# EAGLE design dwengo-1.1 (EAGLE 6.2)
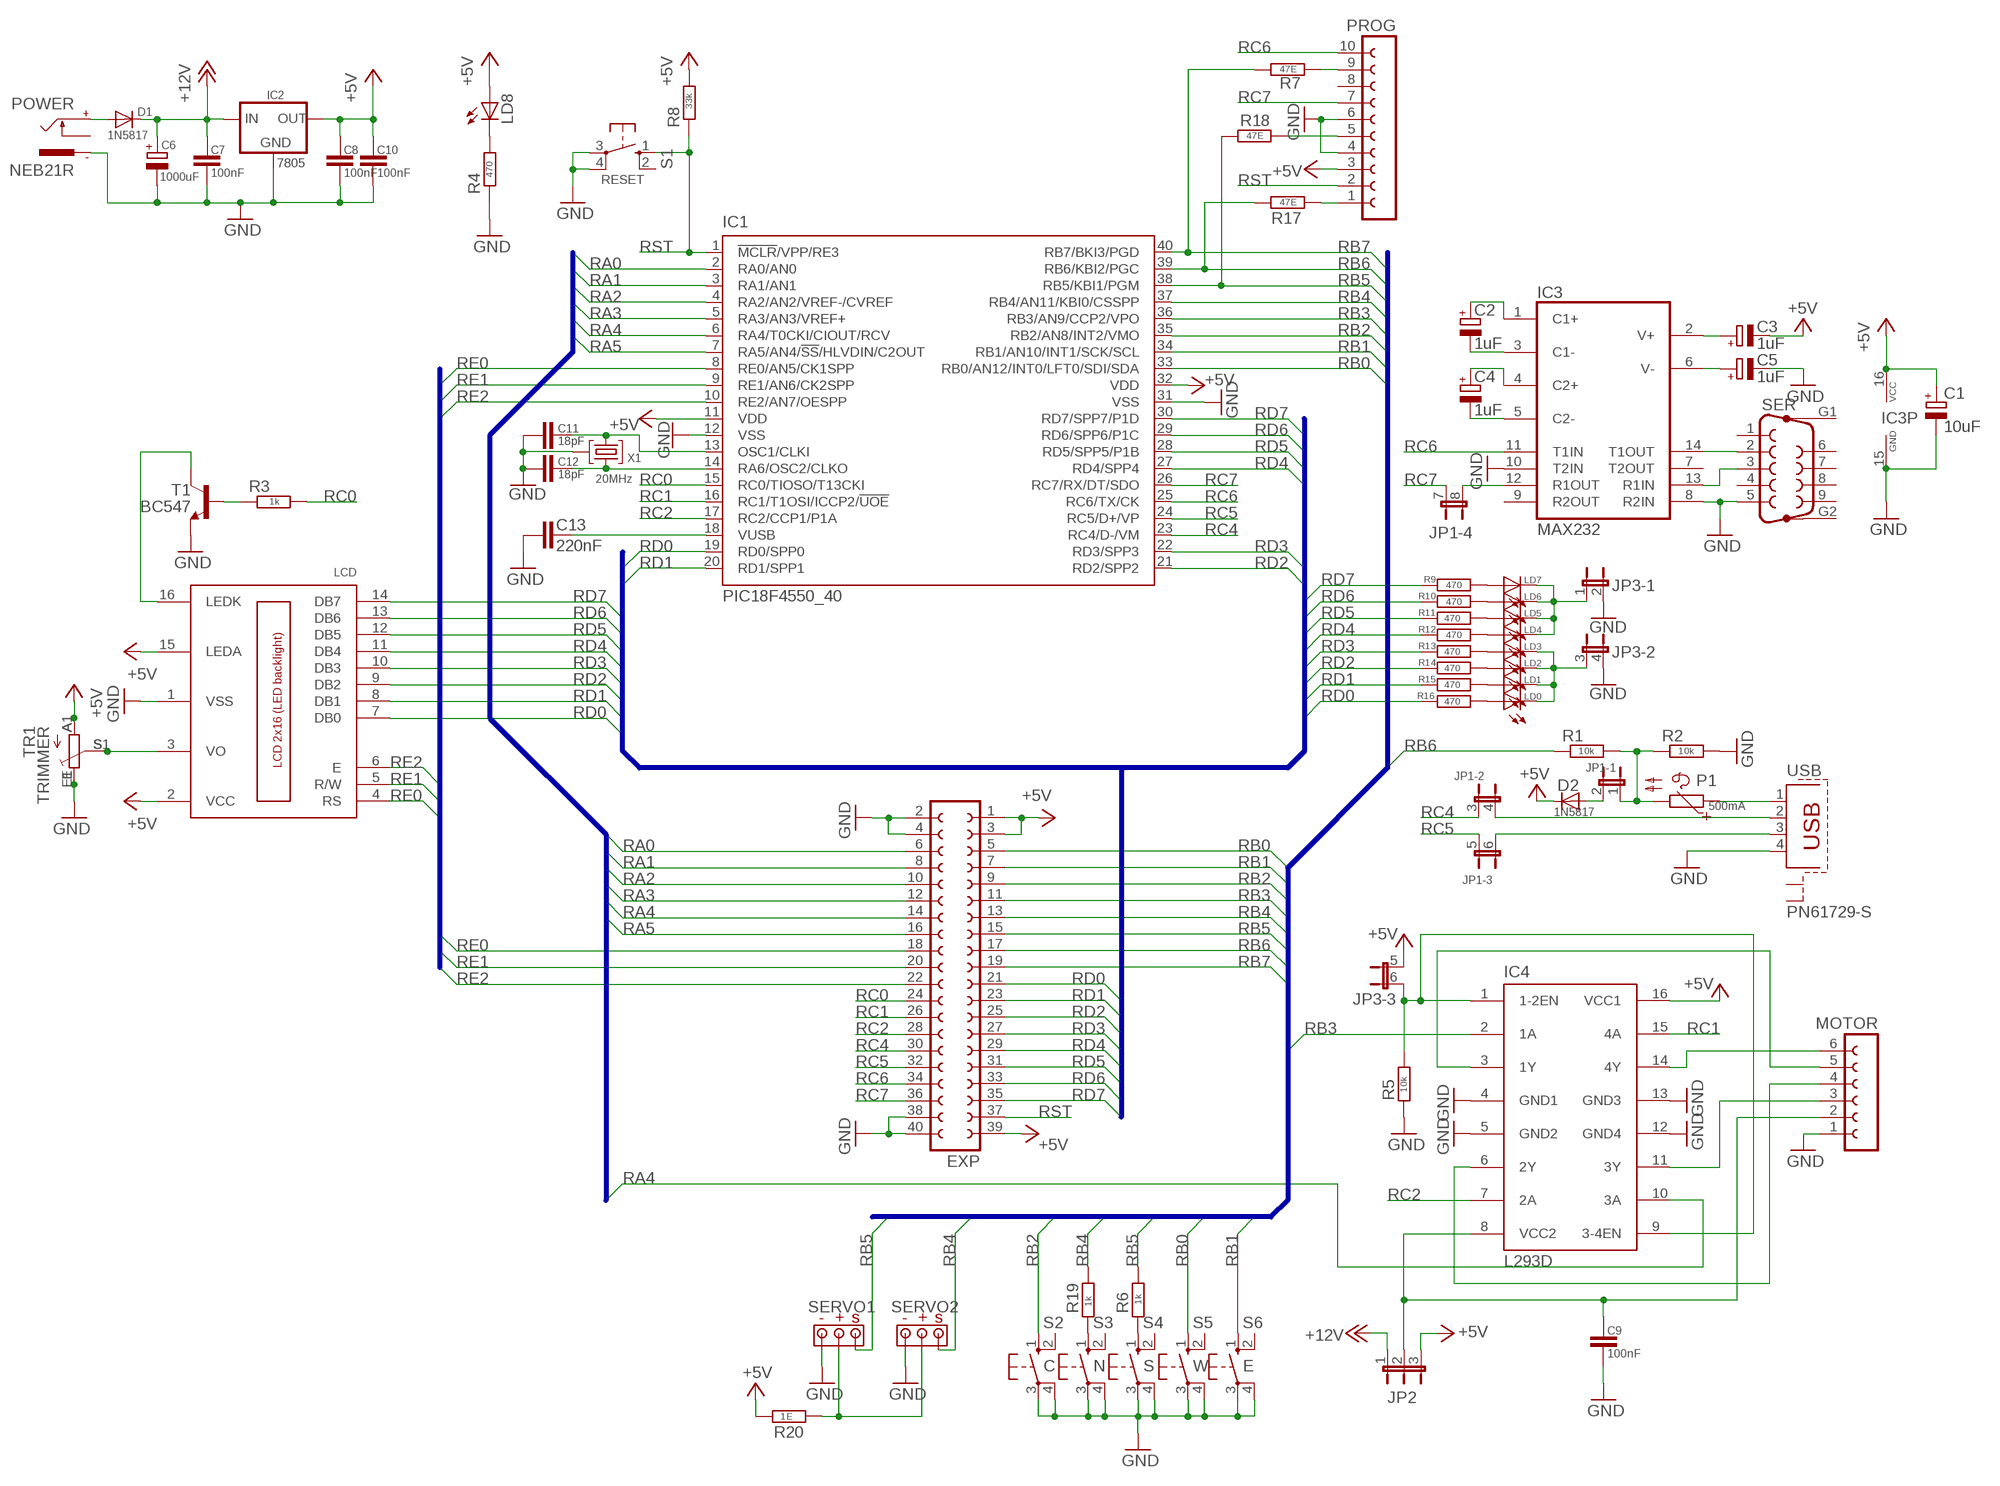
[diagram p0: schematic, sheet 1]

## Parts
C1  10uF  CPOL-EUE2-5  [E2-5]
C2  1uF  CPOL-EUE2-5  [E2-5]
C3  1uF  CPOL-EUE2-5  [E2-5]
C4  1uF  CPOL-EUE2-5  [E2-5]
C5  1uF  CPOL-EUE2-5  [E2-5]
C6  1000uF  CPOL-EUE5-10.5  [E5-10,5]
C7  100nF  C-EU050-025X075  [C-EU050-025X075]
C8  100nF  C-EU050-025X075  [C-EU050-025X075]
C9  100nF  C-EU050-025X075  [C-EU050-025X075]
C10  100nF  C-EU050-025X075  [C-EU050-025X075]
C11  18pF  C-EU050-024X044  [C-EU050-024X044]
C12  18pF  C-EU050-024X044  [C-EU050-024X044]
C13  220nF  C-EU050-035X075  [C-EU050-035X075]
D1  1N5817  1N4004  [DO41-10]
D2  1N5817  1N4004  [DO41-10]
EXP  FE20-2W  [FE20-2W]
IC1  PIC18F4550_40  PIC18F4455_40  [DIL40]
IC2  7805  78XXS  [78XXS]
IC3  MAX232  [DIL16]
IC4  L293D  [DIL16]
JP1  JP2_4  [JP2_4]
JP2  JP_3MOTOR  [JP_MOTOR]
JP3  JP3QE  [JP3Q]
LCD  LCD_2X16  [HY-1602F]
LD0  LED3MM  [LED3MM]
LD1  LED3MM  [LED3MM]
LD2  LED3MM  [LED3MM]
LD3  LED3MM  [LED3MM]
LD4  LED3MM  [LED3MM]
LD5  LED3MM  [LED3MM]
LD6  LED3MM  [LED3MM]
LD7  LED3MM  [LED3MM]
LD8  LED3MM  [LED3MM]
MOTOR  MOTOR  [MOTOR]
P1  500mA  POLYSWITCH  [POLYSWITCH]
POWER  NEB21R  [NEB21R]
PROG  PROG_CONNECTOR  [PROG_CONNECTOR]
R1  10k  R-EU_0204/7  [0204/7]
R2  10k  R-EU_0204/7  [0204/7]
R3  1k  R-EU_0204/7  [0204/7]
R4  470  R-EU_0204/7  [0204/7]
R5  10k  R-EU_0204/7  [0204/7]
R6  1k  R-EU_0204/7  [0204/7]
R7  47E  R-EU_0204/7  [0204/7]
R8  33k  R-EU_0204/7  [0204/7]
R9  470  R-EU_0204/7  [0204/7]
R10  470  R-EU_0204/7  [0204/7]
R11  470  R-EU_0204/7  [0204/7]
R12  470  R-EU_0204/7  [0204/7]
R13  470  R-EU_0204/7  [0204/7]
R14  470  R-EU_0204/7  [0204/7]
R15  470  R-EU_0204/7  [0204/7]
R16  470  R-EU_0204/7  [0204/7]
R17  47E  R-EU_0204/7  [0204/7]
R18  47E  R-EU_0204/7  [0204/7]
R19  1k  R-EU_0204/7  [0204/7]
R20  1E  R-EU_0204/7  [0204/7]
S1  10-XX  [B3F-10XX]
S2  10-XX  [B3F-10XX]
S3  10-XX  [B3F-10XX]
S4  10-XX  [B3F-10XX]
S5  10-XX  [B3F-10XX]
S6  10-XX  [B3F-10XX]
SER  F09HP  [F09HP]
SERVO1  SERVO  [SERVO]
SERVO2  SERVO  [SERVO]
T1  BC547  [TO92]
TR1  TRIMMER  [TRIMMER]
USB  PN61729-S  [PN61729-S]
X1  20MHz  CRYSTAL_RES  [CRYSTAL_RES]

## Nets
+5V: C1.+ C3.- C8.2 C10.2 D2.C EXP.1 EXP.3 EXP.39 IC1.11(VDD) IC1.32(VDD) IC2.OUT IC3.16(VCC) IC4.16(VCC1) JP2.3 JP3.5 LCD.2(VCC) LCD.15(LEDA) LD8.A PROG.3 R8.2 R20.1 TR1.A TR1.A1
+12V: C6.+ C7.2 D1.C IC2.IN JP2.1
GND: C1.- C5.- C6.- C7.1 C8.1 C9.1 C10.1 C11.2 C12.2 C13.2 EXP.2 EXP.4 EXP.38 EXP.40 IC1.12(VSS) IC1.31(VSS) IC2.GND IC3.8(R2IN) IC3.10(T2IN) IC3.15(GND) IC4.4(GND1) IC4.5(GND2) IC4.12(GND4) IC4.13(GND3) JP3.2 JP3.4 LCD.1(VSS) MOTOR.1 POWER.- PROG.4 PROG.6 R2.2 R4.1 R5.1 S1.3(P) S1.4(P1) S2.3(P) S2.4(P1) S3.3(P) S3.4(P1) S4.3(P) S4.4(P1) S5.3(P) S5.4(P1) S6.3(P) S6.4(P1) SER.5 SERVO1.- SERVO2.- T1.1(E) TR1.E TR1.E1 USB.4 X1.P$1
N$1: C9.2 IC4.8(VCC2) JP2.2 MOTOR.2
N$2: C11.1 IC1.13(OSC1/CLKI) X1.2
N$3: C12.1 IC1.14(RA6/OSC2/CLKO) X1.1
N$14: C2.+ IC3.1(C1+)
N$15: C2.- IC3.3(C1-)
N$16: C4.+ IC3.4(C2+)
N$17: C4.- IC3.5(C2-)
N$18: IC3.13(R1IN) SER.3
N$37: LCD.3(VO) TR1.S TR1.S1
N$38: LD7.A R9.2
N$39: LD6.A R10.2
N$40: LD5.A R11.2
N$41: LD4.A R12.2
N$42: LD3.A R13.2
N$43: LD2.A R14.2
N$44: LD1.A R15.2
N$45: LD0.A R16.2
N$46: JP3.1 LD4.K(C) LD5.K(C) LD6.K(C) LD7.K(C)
N$47: JP3.3 LD0.K(C) LD1.K(C) LD2.K(C) LD3.K(C)
N$48: C13.1 IC1.18(VUSB)
N$49: C3.+ IC3.2(V+)
N$50: C5.+ IC3.6(V-)
N$51: IC3.14(T1OUT) SER.2
N$52: LCD.16(LEDK) T1.3(C)
N$53: LD8.K(C) R4.2
N$54: IC3.12(R1OUT) JP1.8
N$55: JP1.6 USB.3
N$58: R3.1 T1.2(B)
N$59: P1.1 USB.1
N$60: D2.A JP1.2
N$61: D1.A POWER.+
N$64: IC4.14(4Y) MOTOR.6
N$65: IC4.11(3Y) MOTOR.3
N$66: IC4.1(1-2EN) IC4.9(3-4EN) JP3.6 R5.2
N$67: IC4.6(2Y) MOTOR.4
N$68: IC4.3(1Y) MOTOR.5
N$70: JP1.4 USB.2
N$71: PROG.9 R7.2
N$72: PROG.1 R17.2
N$73: PROG.5 R18.2
N$74: JP1.1 P1.2 R1.1 R2.1
N$75: R19.1 S3.1(S)
N$76: R6.1 S4.1(S)
N$77: R20.2 SERVO1.+ SERVO2.+
RA0: EXP.6 IC1.2(RA0/AN0)
RA1: EXP.8 IC1.3(RA1/AN1)
RA2: EXP.10 IC1.4(RA2/AN2/VREF-/CVREF)
RA3: EXP.12 IC1.5(RA3/AN3/VREF+)
RA4: EXP.14 IC1.6(RA4/T0CKI/CIOUT/RCV) IC4.10(3A)
RA5: EXP.16 IC1.7(RA5/AN4/!SS!/HLVDIN/C2OUT)
RB0: EXP.5 IC1.33(RB0/AN12/INT0/LFT0/SDI/SDA) S5.1(S)
RB1: EXP.7 IC1.34(RB1/AN10/INT1/SCK/SCL) S6.1(S)
RB2: EXP.9 IC1.35(RB2/AN8/INT2/VMO) S2.1(S)
RB3: EXP.11 IC1.36(RB3/AN9/CCP2/VPO) IC4.2(1A)
RB4: EXP.13 IC1.37(RB4/AN11/KBI0/CSSPP) R19.2 SERVO2.S
RB5: EXP.15 IC1.38(RB5/KBI1/PGM) R6.2 R18.1 SERVO1.S
RB6: EXP.17 IC1.39(RB6/KBI2/PGC) R1.2 R17.1
RB7: EXP.19 IC1.40(RB7/BKI3/PGD) R7.1
RC0: EXP.24 IC1.15(RC0/TIOSO/T13CKI) R3.2
RC1: EXP.26 IC1.16(RC1/T1OSI/ICCP2/!UOE) IC4.15(4A)
RC2: EXP.28 IC1.17(RC2/CCP1/P1A) IC4.7(2A)
RC4: EXP.30 IC1.23(RC4/D-/VM) JP1.3
RC5: EXP.32 IC1.24(RC5/D+/VP) JP1.5
RC6: EXP.34 IC1.25(RC6/TX/CK) IC3.11(T1IN) PROG.10
RC7: EXP.36 IC1.26(RC7/RX/DT/SDO) JP1.7 PROG.7
RD0: EXP.21 IC1.19(RD0/SPP0) LCD.7(DB0) R16.1
RD1: EXP.23 IC1.20(RD1/SPP1) LCD.8(DB1) R15.1
RD2: EXP.25 IC1.21(RD2/SPP2) LCD.9(DB2) R14.1
RD3: EXP.27 IC1.22(RD3/SPP3) LCD.10(DB3) R13.1
RD4: EXP.29 IC1.27(RD4/SPP4) LCD.11(DB4) R12.1
RD5: EXP.31 IC1.28(RD5/SPP5/P1B) LCD.12(DB5) R11.1
RD6: EXP.33 IC1.29(RD6/SPP6/P1C) LCD.13(DB6) R10.1
RD7: EXP.35 IC1.30(RD7/SPP7/P1D) LCD.14(DB7) R9.1
RE0: EXP.18 IC1.8(RE0/AN5/CK1SPP) LCD.4(RS)
RE1: EXP.20 IC1.9(RE1/AN6/CK2SPP) LCD.5(R/W)
RE2: EXP.22 IC1.10(RE2/AN7/OESPP) LCD.6(E)
RST: EXP.37 IC1.1(!MCLR!/VPP/RE3) PROG.2 R8.1 S1.1(S)
Unconnected: IC3.7(T2OUT) IC3.9(R2OUT) POWER.C PROG.8 S1.2(S1) S2.2(S1) S3.2(S1) S4.2(S1) S5.2(S1) S6.2(S1) SER.1 SER.4 SER.6 SER.7 SER.8 SER.9 SER.G1 SER.G2 USB.S1 USB.S2

## Buses
RA[0..5]
RE[0..2]
RB[0..7]
RD[0..7]

## Notes on the sheet
- RESET
- C | N | S | W | E

## Library data of the parts
C1-C6 = rcl:CPOL-EU: POLARIZED CAPACITOR, European symbol
C7-C10 = dwengo:C-EU050-025X075
C11 C12 = dwengo:C-EU050-024X044
C13 = dwengo:C-EU050-035X075
D1 D2 = diode:1N4004: DIODE general purpose rectifier, 1 A
EXP = con-lsta:FE20-2W: FEMALE HEADER
IC1 = microchip:PIC18F4*_40: USB Microcontrollers with nanoWatt Technology High-Performance, Enhanced Flash, 28/40/44-Pin, Source: http://ww1.microchip.com/downloads/en/devicedoc/39632c.pdf
IC2 = v-reg:78XXS: VOLTAGE REGULATOR
IC3 = maxim:MAX232: RS232 TRANSEIVER
IC4 = st-microelectronics:L293D: PUSH-PULL 4 CHANNEL DRIVER
JP1 = dwengo:JP2_4
JP2 = dwengo:JP_3
JP3 = jumper:JP3QE: JUMPER
LCD = lcd_2x16_led_backlight:LCD_2X16
LD0 LD1-LD8 = dwengo:LED3MM
MOTOR = dwengo:MOTOR
P1 = dwengo:POLYSWITCH
POWER = con-lumberg:NEB21R: Klinkeneinbaukupplung
PROG = dwengo:PROG_CONNECTOR
R1-R20 = rcl:R-EU_: RESISTOR, European symbol
S1-S6 = switch-omron:10-XX: OMRON SWITCH
SER = con-subd:F09HP: SUB-D
SERVO1 SERVO2 = dwengo:SERVO
T1 = transistor:BC547: NPN TRANSISTOR
TR1 = dwengo:TRIMMER
USB = con-berg:PN61729-S: BERG USB connector
X1 = welek:CRYSTAL_RES

## Board
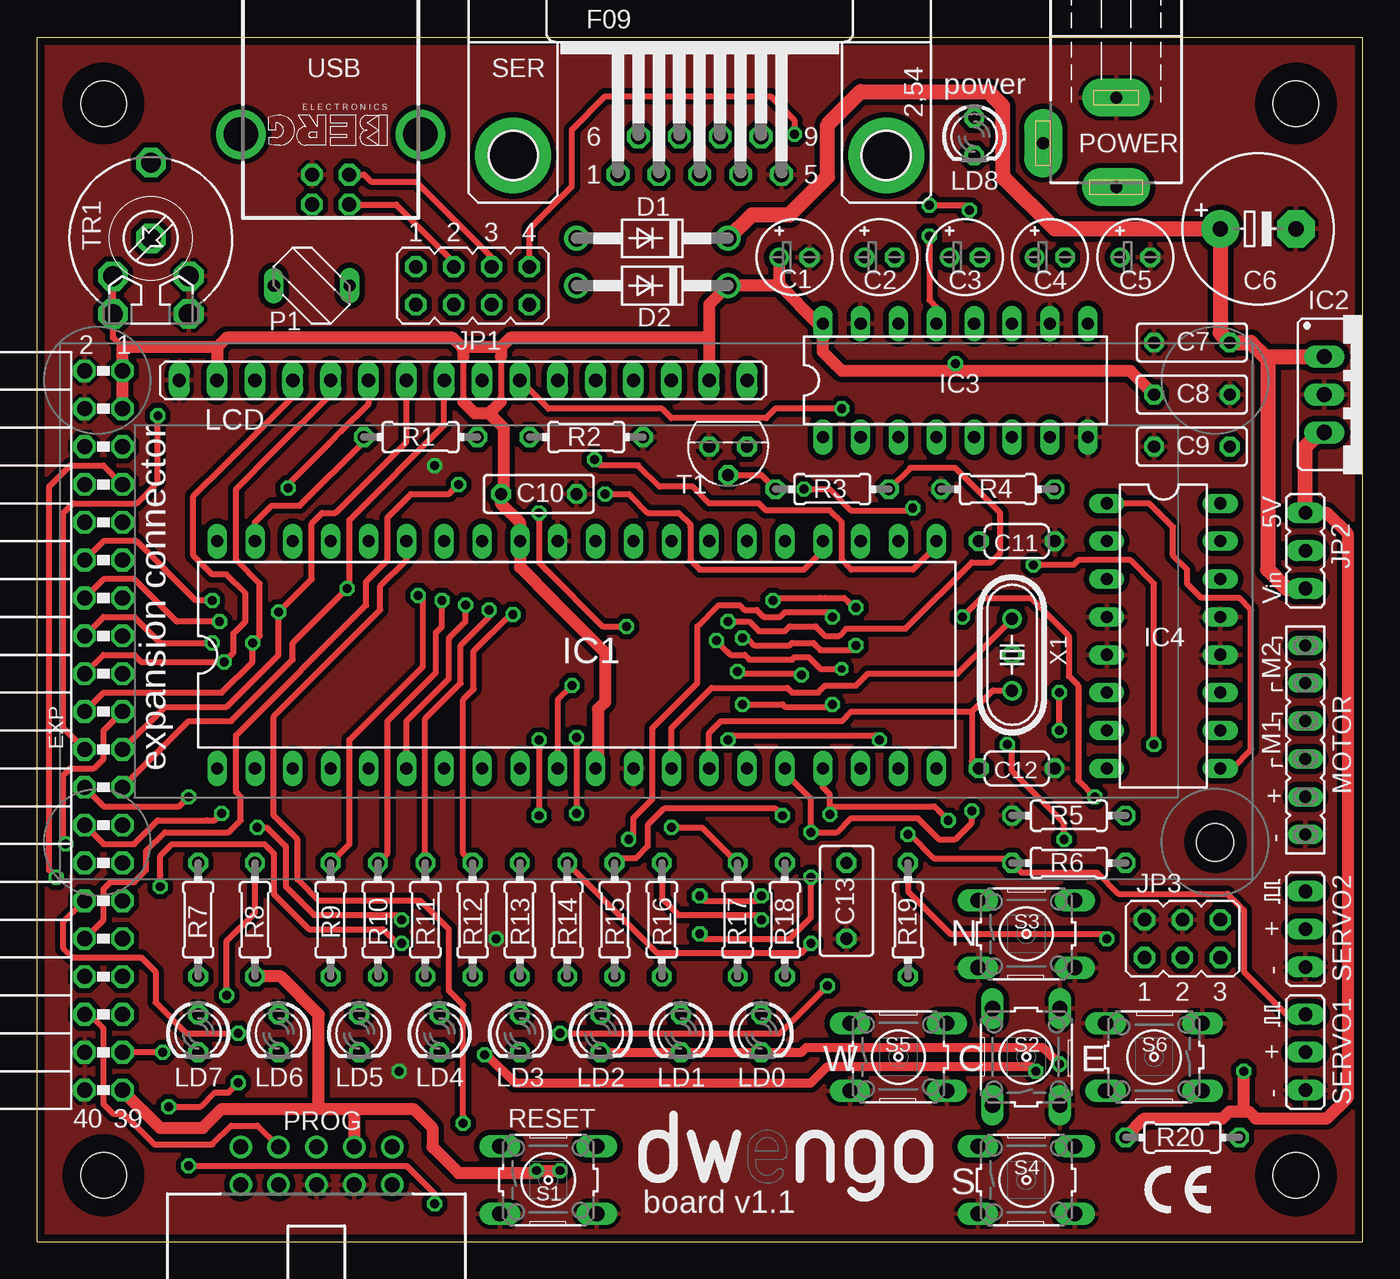
[diagram p1: board, top side]
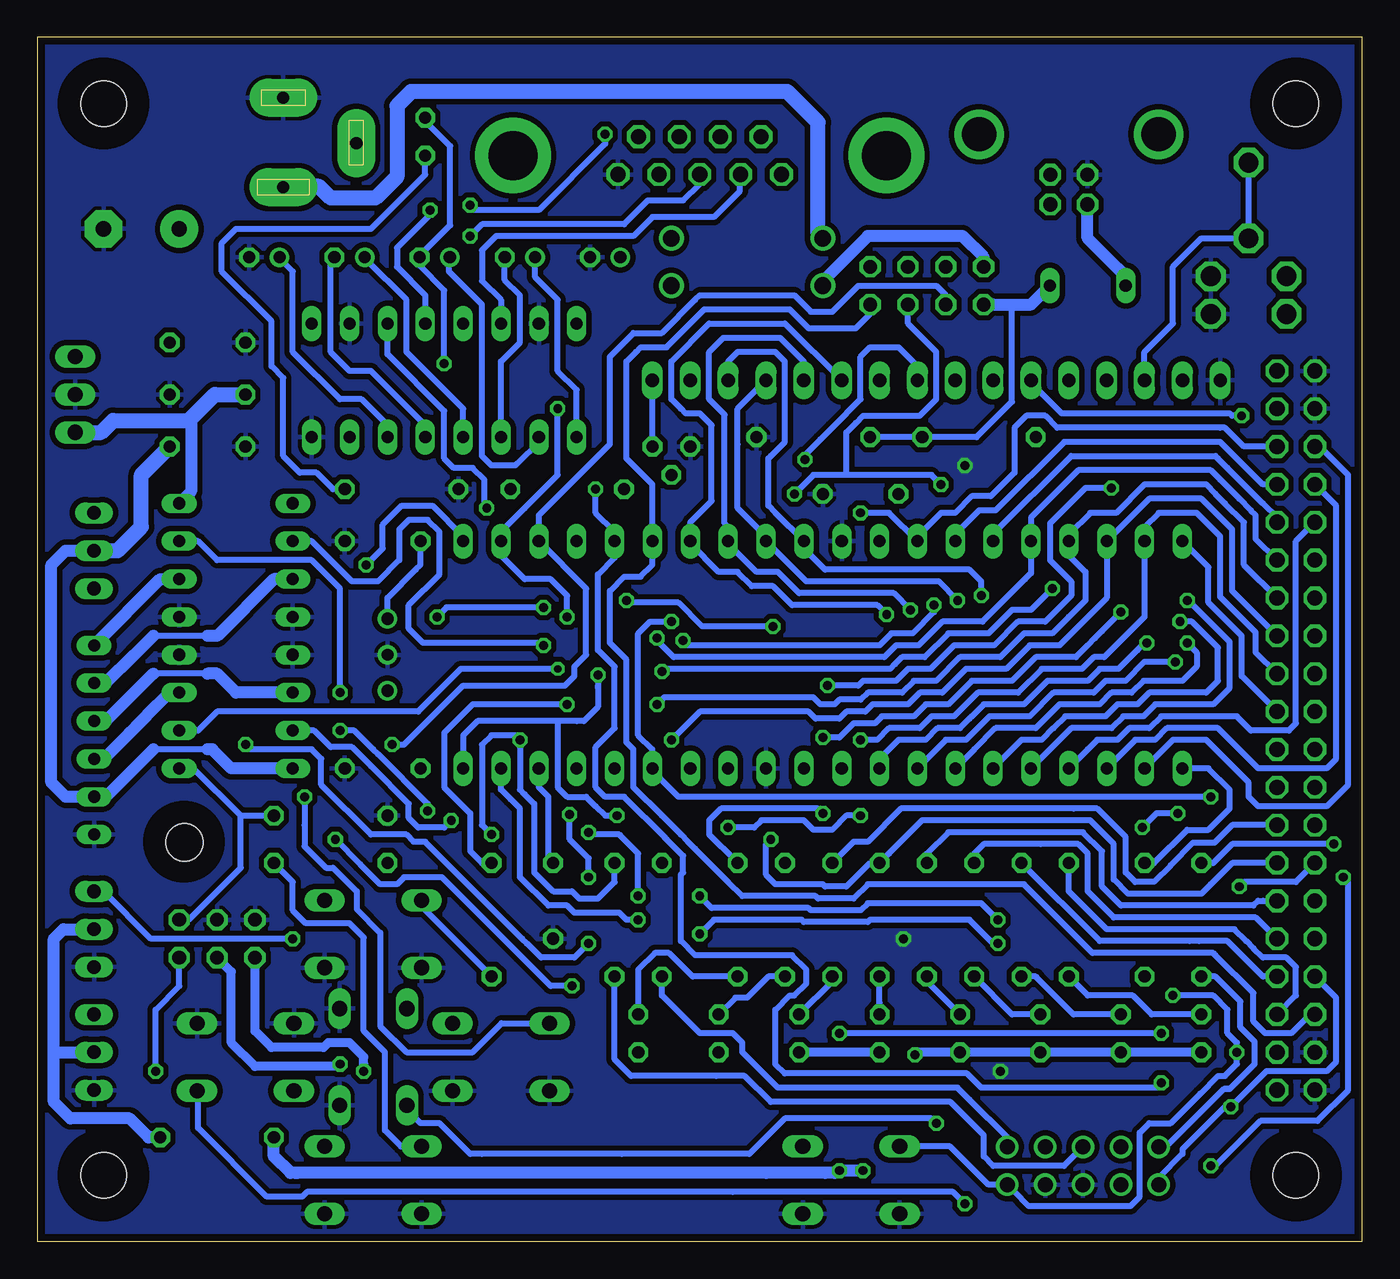
[diagram p2: board, bottom side, seen from below]

Size 88.9 x 80.8 mm. Coordinates in mm from the lower left corner, seen from the top.
Outline: 0,80.8 88.9,80.8 88.9,0 0,0 0,80.8
Copper layers (1*16): Top 0.035mm / dielectric 1.6mm / Bottom 0.035mm
Design rules: minimum track width 12mil, minimum drill 16mil, track to track 14mil, track to pad 14mil, pad to pad 14mil, via to via 14mil, smd to smd 14mil, copper to edge 20mil, drill to drill 16mil, minimum pad ring 10mil, minimum via ring 8mil, stop-mask expansion 4mil, vias tented up to drill 0mil, thermal gap 10mil
Holes 3.05 mm at 4.45,76.36 84.45,76.36 4.45,4.45 84.45,4.45
tRestrict: area 81.9,73.8 to 87,78.9; area 1.9,73.8 to 7,78.9; area 1.9,1.9 to 7,7; area 81.9,1.9 to 87,7; area 77.2,24.9 to 81,28.7
bRestrict: area 1.6,73.5 to 7.3,79.2; area 76.5,24.3 to 81.6,29.4; area 81.6,73.5 to 87.3,79.2; area 81.6,1.6 to 87.3,7.3; area 1.6,1.6 to 7.3,7.3

### Footprints (pad centres in the part's own frame; a part is rotated, then mirrored left to right if it is on the bottom)
E2-5 = drill 0.813 pad 1.27: + -1.016,0 | drill 0.813 pad 1.27 octagon: - 1.016,0
E5-10,5 = drill 1.016 pad 2.54: + -2.54,0 | drill 1.016 pad 2.54 octagon: - 2.54,0
C-EU050-025X075 = drill 0.813 octagon: 1 -2.54,0; 2 2.54,0
C-EU050-024X044 = drill 0.813 octagon: 1 -2.54,0; 2 2.54,0
C-EU050-035X075 = drill 0.813 octagon: 1 -2.54,0; 2 2.54,0
DO41-10 = drill 1.118: A 5.08,0; C -5.08,0
FE20-2W = drill 1.016 octagon: 1 -24.13,1.27; 2 -24.13,-1.27; 3 -21.59,1.27; 4 -21.59,-1.27; 5 -19.05,1.27; 6 -19.05,-1.27; 7 -16.51,1.27; 8 -16.51,-1.27; 9 -13.97,1.27; 10 -13.97,-1.27; 11 -11.43,1.27; 12 -11.43,-1.27; 13 -8.89,1.27; 14 -8.89,-1.27; 15 -6.35,1.27; 16 -6.35,-1.27; 17 -3.81,1.27; 18 -3.81,-1.27; 19 -1.27,1.27; 20 -1.27,-1.27; 21 1.27,1.27; 22 1.27,-1.27; 23 3.81,1.27; 24 3.81,-1.27; 25 6.35,1.27; 26 6.35,-1.27; 27 8.89,1.27; 28 8.89,-1.27; 29 11.43,1.27; 30 11.43,-1.27; 31 13.97,1.27; 32 13.97,-1.27; 33 16.51,1.27; 34 16.51,-1.27; 35 19.05,1.27; 36 19.05,-1.27; 37 21.59,1.27; 38 21.59,-1.27; 39 24.13,1.27; 40 24.13,-1.27
DIL40 = drill 0.813 long: 1 -24.13,-7.62; 2 -21.59,-7.62; 3 -19.05,-7.62; 4 -16.51,-7.62; 5 -13.97,-7.62; 6 -11.43,-7.62; 7 -8.89,-7.62; 8 -6.35,-7.62; 9 -3.81,-7.62; 10 -1.27,-7.62; 11 1.27,-7.62; 12 3.81,-7.62; 13 6.35,-7.62; 14 8.89,-7.62; 15 11.43,-7.62; 16 13.97,-7.62; 17 16.51,-7.62; 18 19.05,-7.62; 19 21.59,-7.62; 20 24.13,-7.62; 21 24.13,7.62; 22 21.59,7.62; 23 19.05,7.62; 24 16.51,7.62; 25 13.97,7.62; 26 11.43,7.62; 27 8.89,7.62; 28 6.35,7.62; 29 3.81,7.62; 30 1.27,7.62; 31 -1.27,7.62; 32 -3.81,7.62; 33 -6.35,7.62; 34 -8.89,7.62; 35 -11.43,7.62; 36 -13.97,7.62; 37 -16.51,7.62; 38 -19.05,7.62; 39 -21.59,7.62; 40 -24.13,7.62
78XXS = drill 1.016 long: GND 0,-2.54; IN -2.54,-2.54; OUT 2.54,-2.54
DIL16 = drill 0.813 long: 1 -8.89,-3.81; 2 -6.35,-3.81; 3 -3.81,-3.81; 4 -1.27,-3.81; 5 1.27,-3.81; 6 3.81,-3.81; 7 6.35,-3.81; 8 8.89,-3.81; 9 8.89,3.81; 10 6.35,3.81; 11 3.81,3.81; 12 1.27,3.81; 13 -1.27,3.81; 14 -3.81,3.81; 15 -6.35,3.81; 16 -8.89,3.81
JP2_4 = drill 0.914 octagon: 1 -3.81,-1.27; 2 -3.81,1.27; 3 -1.27,-1.27; 4 -1.27,1.27; 5 1.27,-1.27; 6 1.27,1.27; 7 3.81,-1.27; 8 3.81,1.27
JP_MOTOR = drill 0.914 long: 1 -2.54,0; 2 0,0; 3 2.54,0
JP3Q = drill 0.914 octagon: 1 -2.54,-1.27; 2 -2.54,1.27; 3 0,-1.27; 4 0,1.27; 5 2.54,-1.27; 6 2.54,1.27
HY-1602F = drill 0.9 pad 1.422 long: 1 2.54,0; 2 5.08,0; 3 7.62,0; 4 10.16,0; 5 12.7,0; 6 15.24,0; 7 17.78,0; 8 20.32,0; 9 22.86,0; 10 25.4,0; 11 27.94,0; 12 30.48,0; 13 33.02,0; 14 35.56,0; 15 38.1,0; 16 40.64,0 | hole 2.5: 72.04,-31
LED3MM = drill 0.813 octagon: A -1.27,0; K 1.27,0
MOTOR = drill 0.813 long: 1 -6.35,0; 2 -3.81,0; 3 -1.27,0; 4 1.27,0; 5 3.81,0; 6 6.35,0
POLYSWITCH = drill 0.813 long: 1 -2.54,0; 2 2.54,0
NEB21R = drill 0.813 pad 2.54 long: + 0,7.35; - 0,1.35; C 4.9,4.4
PROG_CONNECTOR = drill 1 pad 1.422: 1 -5.08,-2.54; 2 -5.08,0; 3 -2.54,-2.54; 4 -2.54,0; 5 0,-2.54; 6 0,0; 7 2.54,-2.54; 8 2.54,0; 9 5.08,-2.54; 10 5.08,0
0204/7 = drill 0.813 octagon: 1 -3.81,0; 2 3.81,0
B3F-10XX = drill 1.016 long: 1 -3.251,2.261; 2 3.251,2.261; 3 -3.251,-2.261; 4 3.251,-2.261
F09HP = drill 1.016 octagon: 1 -5.486,-1.27; 2 -2.743,-1.27; 3 0,-1.27; 4 2.743,-1.27; 5 5.486,-1.27; 6 -4.115,1.27; 7 -1.372,1.27; 8 1.372,1.27; 9 4.115,1.27 | drill 3.302 pad 5.08: G1 -12.522,0; G2 12.522,0
SERVO = drill 0.914 long: + 0,0; - -2.54,0; S 2.54,0
TO92 = drill 0.813 octagon: 1 1.27,0; 2 0,1.905; 3 -1.27,0
TRIMMER = drill 1.321 octagon: A -2.54,-5.08; A1 -2.54,-2.54; E 2.54,-5.08; E1 2.54,-2.54; S 0,5.08; S1 0,0
PN61729-S = drill 0.95 octagon: 1 1.25,4.71; 2 -1.25,4.71; 3 -1.25,2.71; 4 1.25,2.71 | drill 2.3 pad 2.9: S1 -6.02,0; S2 6.02,0
CRYSTAL_RES = drill 0.813: 1 -2.413,0; 2 2.413,0 | drill 0.8: P$1 0,0

### Placement (x,y rotation side)
C1  50.8,66.04 0 top
C2  56.51,66.04 0 top
C3  62.23,66.04 0 top
C4  67.94,66.04 0 top
C5  73.66,66.04 0 top
C6  81.91,67.95 0 top
C7  77.47,60.33 0 top
C8  77.47,56.83 180 top
C9  77.47,53.34 0 top
C10  33.66,50.16 180 top
C11  65.72,46.99 0 top
C12  65.72,31.75 0 top
C13  54.29,22.86 270 top
D1  41.27,67.31 180 top
D2  41.27,64.14 180 top
EXP  4.45,34.29 270 top
IC1  36.2,39.37 0 top
IC2  88.9,56.83 270 top
IC3  61.59,57.78 0 top
IC4  75.56,40.64 270 top
JP1  29.21,64.14 0 top
JP2  85.09,46.35 90 top
JP3  76.83,20.32 0 top
LCD  6.99,57.78 0 top
LD0  48.58,13.97 270 top
LD1  43.18,13.97 270 top
LD2  37.78,13.97 270 top
LD3  32.39,13.97 270 top
LD4  26.99,13.97 270 top
LD5  21.59,13.97 270 top
LD6  16.19,13.97 270 top
LD7  10.79,13.97 270 top
LD8  62.87,74.14 270 top
MOTOR  85.09,33.66 90 top
P1  18.42,64.14 0 top
POWER  72.39,78.11 180 top
PROG  18.73,3.81 180 top
R1  25.72,53.98 180 top
R2  36.83,53.98 0 top
R3  53.34,50.48 0 top
R4  64.45,50.48 0 top
R5  69.22,28.57 0 top
R6  69.21,25.4 180 top
R7  10.79,21.59 270 top
R8  14.61,21.59 270 top
R9  19.68,21.59 270 top
R10  22.86,21.59 270 top
R11  26.04,21.59 270 top
R12  29.21,21.59 270 top
R13  32.38,21.59 270 top
R14  35.56,21.59 270 top
R15  38.73,21.59 270 top
R16  41.91,21.59 270 top
R17  46.99,21.59 270 top
R18  50.16,21.59 270 top
R19  58.42,21.59 90 top
R20  76.84,6.99 0 top
S1  34.29,4.13 0 top
S2  66.36,12.38 90 top
S3  66.36,20.64 0 top
S4  66.36,4.13 0 top
S5  57.79,12.38 0 top
S6  74.93,12.38 180 top
SER  44.45,72.87 0 top
SERVO1  85.09,12.7 90 top
SERVO2  85.09,20.95 90 top
T1  46.35,53.34 180 top
TR1  7.62,67.31 0 top
U$1  [LOGO_ML]  40.64,3.97 0 top
U$4  [CE_MED]  76.52,3.49 0 top
USB  19.68,74.3 180 top
X1  65.41,39.37 90 top

### Tracks (layer width: path | path; a pad name or v marks a point on that pad's centre or on a via)
+5V  (via drill 0.6)
  Top 0.406: 31.11,59.37 31.11,56.36 | 28.57,59.37 28.57,56.36 | 5.71,60.01 5.08,60.64 TR1.A TR1.A1 | 61.59,58.42 v61.59,58.9
  Top 0.813: 12.06,60.01 LCD.2 12.06,57.47 | EXP.3 EXP.1 5.71,60.01 12.06,60.01 | 31.11,56.36 30.48,55.72 30.32,55.56 | 30.32,55.56 30.64,55.24 31.27,54.61 31.27,50.32 C10.2 | 45.09,60.64 45.09,57.47 44.77,57.15 LCD.15 45.09,60.64 | 45.09,60.64 31.75,60.64 31.11,60.01 | 31.11,60.01 28.57,60.01 | 31.11,60.01 31.11,59.37 | IC1.11 37.62,32.07 37.62,33.18 37.62,35.72 38.1,36.2 38.1,39.53 34.61,43.02 32.38,45.24 IC1.32 32.38,48.26 31.11,49.53 C10.2 | 18.89,8.89 12.38,8.89 11.11,7.62 8.26,7.62 EXP.39 | 18.89,8.89 21.27,8.89 | 21.27,8.89 25.24,8.89 26.51,7.62 26.51,6.35 28.26,4.6 33.5,4.6 33.66,4.76 v33.5,4.76 v35.08,4.76 | 28.57,60.01 28.57,59.37 | 28.57,56.36 29.37,55.56 30.32,55.56 | 18.89,8.89 18.89,15.24 16.35,17.78 R8.2 | 12.06,60.01 12.7,60.64 27.86,60.64 28.5,60.01 28.57,60.01 | IC3.16 | IC3.16 | C1.+ 49.78,64.2 52.39,61.59 | IC3.16 52.39,61.59 | D2.C 49.85,64.14 52.39,61.59 | IC3.16 52.7,59.69 53.98,58.42 61.59,58.42 73.34,58.42 C8.2 | D2.C | D2.C 45.09,62.87 45.09,60.64 | 80.01,8.73 79.53,8.26 78.74,8.26 74.3,8.26 R20.1 | 80.01,8.73 81.28,8.73 81.76,8.26 86.52,8.26 87.95,9.68 87.95,24.92 87.95,25.24 87.95,47.47 86.52,48.9 JP2.3 | v80.96,11.43 80.96,8.73 80.01,8.73 | C10.2 | PROG.3 | 21.27,8.89 PROG.3
  Top 1.016: IC2.OUT 86.04,54.29 85.09,53.34 JP2.3
  Bottom 0.406: C3.- 63.25,66.14 | C3.- 63.25,65.47 61.59,63.82 v61.59,58.9 | LD8.A 62.87,75.17 62.31,74.61 61.2,73.5 61.2,68.18 63.25,66.14 | LD8.A | JP3.5 79.38,17.14 80.96,15.56 80.96,12.22 v80.96,11.43 | C3.- 63.25,66.14
  Bottom 0.813: v33.5,4.76 35.24,4.76 35.4,4.6 36.04,4.6 40.01,4.6 71.44,4.6 71.6,4.6 71.91,4.6 73.03,5.71 R20.1 | IC4.16 78.58,50.32 78.58,55.24
  Bottom 1.016: IC2.OUT 84.61,54.29 83.82,55.09 78.74,55.09 78.58,55.24 76.99,56.83 C8.2 | C8.2 | C8.2
+12V
  Top 1.016: 82.39,59.37 82.55,59.37 82.55,45.09 83.82,43.81 JP2.1 | 82.39,59.37 IC2.IN | 82.39,59.37 81.44,60.33 C7.2 | D1.C | D1.C 47.94,68.9 50.48,68.9 53.02,71.44 53.02,74.93 55.24,77.15 63.82,77.15 64.77,76.2 64.77,71.44 68.26,67.94 68.58,67.94 69.22,67.94 79.69,67.94 80.01,67.63 | C7.2 79.38,60.96 C6.+ 80.01,67.63 | 80.01,67.63 | C7.2
GND  (via drill 0.6, 0.6 pad 0.25)
  other vias: 26.67,52.07 24.29,11.43 30.8,20.32
  pour Bottom: -0.32,80.96 88.9,80.96 88.9,0 -0.32,0
  pour Top: -0.32,80.96 88.9,80.96 88.9,0 -0.32,0
N$1
  Bottom 0.406: 77.47,33.02 78.58,33.02 81.12,33.02
  Bottom 0.813: 85.57,46.35 87,46.35 87.95,45.4 87.95,30.8 87,29.84 MOTOR.2 84.3,29.84 82.55,31.59 82.23,31.91 81.12,33.02 | 85.57,46.35 85.25,46.35 | 77.47,33.02 77.15,33.02 75.88,31.75 IC4.8 | 85.57,46.35 JP2.2
  Bottom 1.016: 81.92,47.94 | 81.92,47.94 83.5,46.35 JP2.2 85.25,46.35 | C9.2 81.92,51.44 81.92,47.94
N$2
  Top 0.406: X1.2 65.41,41.75 63.98,40.32 61.75,38.1 | IC1.13 42.55,34.45 45.24,37.15 50.32,37.15 50.64,36.83 52.39,36.83 52.86,37.31 54.93,37.31 55.72,38.1 61.75,38.1 | 61.75,38.1
  Bottom 0.406: X1.2 65.41,43.18 63.5,45.09 63.18,45.4 C11.1
N$3
  Top 0.406: 45.09,31.59 IC1.14 45.09,34.13 45.88,34.92 53.98,34.92 54.61,35.56 62.71,35.56 | X1.1 65.41,36.99 64.14,36.99 63.18,36.04 62.87,35.72 62.71,35.56 | C12.1 62.71,32.23 62.71,35.56
N$14
  Bottom 0.406: C2.+ 55.5,64.71 53.98,63.18 53.98,58.42 52.7,57.15 IC3.1 | IC3.1 | IC3.1
N$15
  Bottom 0.406: C2.- 57.53,64.52 56.52,63.5 56.52,60.33 57.78,59.05 IC3.3 | IC3.3
N$16
  Bottom 0.406: C4.+ 66.83,65.88 64.14,63.18 64.14,59.69 60.33,55.88 IC3.4 | IC3.4 | IC3.4
N$17
  Bottom 0.406: C4.- 68.96,65.79 69.22,65.56 69.22,59.69 67.94,58.42 66.52,58.42 62.87,54.77 62.87,54.13 | 62.87,54.13 | IC3.5 62.87,54.13
N$18  (via drill 0.6)
  Top 0.406: IC3.13 | IC3.13 60.33,62.71 59.85,63.18 59.85,66.83 v59.85,67.47
  Bottom 0.406: SER.3 44.45,70.96 45.56,69.85 47.94,69.85 49.53,68.26 59.05,68.26 v59.85,67.47
N$37
  Bottom 0.406: LCD.3 14.61,59.69 12.7,61.59 12.7,65.41 10.79,67.31 TR1.S1 TR1.S
N$38
  Bottom 0.406: R9.2 18.41,16.51 15.4,16.51 14.13,15.24 LD7.A
N$39
  Bottom 0.406: R10.2 21.91,17.78 21.75,17.62 19.37,15.24 LD6.A
N$40
  Bottom 0.406: LD5.A 23.5,15.24 R11.2
N$41
  Bottom 0.406: R12.2 29.21,17.46 LD4.A
N$42
  Bottom 0.406: LD3.A 32.38,16.03 R13.2
N$43
  Bottom 0.406: R14.2 35.56,17.46 LD2.A
N$44
  Bottom 0.406: R15.2 39.85,17.78 41.27,16.35 42.07,16.35 LD1.A | LD1.A
N$45
  Bottom 0.406: R16.2 44.93,17.78 46.51,19.37 47.47,19.37 48.58,18.26 LD0.A
N$46  (via drill 0.6)
  Top 0.61: v66.99,11.43 66.67,11.75 57.15,11.75 55.09,11.75 53.02,11.75 51.91,10.64 32.07,10.64 30.16,12.54 v30,12.54
  Bottom 0.61: v30,12.54 29.84,12.7 LD4.K LD5.K | JP3.1 74.3,18.73 74.3,15.4 74.3,14.13 73.18,13.02 69.69,13.02 69.37,13.34 67.94,13.34 66.99,12.38 66.99,11.91 v66.99,11.43 | LD5.K 23.5,12.7 | LD5.K LD6.K LD7.K
N$47  (via drill 0.6)
  Top 0.61: v68.58,11.91 67.47,13.02 51.59,13.02 51.28,12.7 50.64,12.7 LD0.K LD1.K | LD1.K 45.09,12.7 | 39.69,12.7 LD2.K LD1.K
  Bottom 0.61: JP3.3 75.88,18.1 75.88,13.34 74.3,11.75 68.74,11.75 v68.58,11.91 | 34.29,12.7 LD3.K LD2.K
N$48
  Bottom 0.406: IC1.18 55.24,30.48 54.61,29.84 54.61,25.88 54.61,25.72 C13.1
N$49
  Bottom 0.406: IC3.2 55.24,53.66 56.67,52.23 | 56.67,52.23 | 56.67,52.23 56.83,52.07 58.42,52.07 59.05,52.7 59.05,62.87 61.28,65.09 61.28,66.04 C3.+
N$50
  Bottom 0.406: IC3.6 65.41,54.77 67.15,56.52 68.58,56.52 71.75,59.69 71.75,65.09 72.71,66.04 | 72.71,66.04 | 72.71,66.04 C5.+
N$51
  Bottom 0.406: IC3.14 57.78,63.18 59.05,64.45 59.05,66.52 58.1,67.47 48.9,67.47 47.62,68.74 43.5,68.74 41.75,70.48 41.75,71.6 SER.2 | SER.2
N$52
  Bottom 0.406: T1.3 LCD.16
N$53
  Bottom 0.406: R4.2 69.06,50.48 70.17,51.59 71.28,51.59 72.39,52.7 72.39,57.94 73.18,58.74 73.18,61.75 76.52,65.09 76.52,66.99 75.56,67.94 66.52,67.94 62.87,71.6 62.87,72.23 LD8.K
N$54  (via drill 0.6)
  Top 0.406: v59.85,69.53 61.75,69.53 62.23,69.53 v62.55,69.22 | v50.8,74.3 50.8,75.25 49.37,76.68 49.21,76.83 38.1,76.83 35.88,74.61 35.88,70.8 33.02,67.94 33.02,66.04 JP1.8
  Bottom 0.406: IC3.12 62.87,63.5 64.77,65.41 64.77,66.67 62.55,68.9 v62.55,69.22 | v62.55,69.22 | v59.85,69.53 59.53,69.22 55.24,69.22 50.8,73.66 v50.8,74.3 | v59.85,69.53
N$55
  Top 0.406: JP1.6 30.48,66.04 25.41,71.11 22.38,71.12 21.92,71.58 20.97,71.58 20.95,71.6 20.94,71.58 USB.3
N$58
  Top 0.406: T1.2 48.58,51.44 49.21,50.8 R3.1
N$59
  Bottom 0.813: P1.1 15.88,64.77 16.35,65.25 18.43,67.33 18.43,69.51 18.41,69.53 18.43,69.55 USB.1
N$60
  Bottom 0.813: 25.4,65.56 25.4,66.04 26.83,67.47 33.18,67.47 36.2,64.45 D2.A | JP1.2 25.4,65.56 | 25.4,65.56
N$61
  Bottom 1.016: D1.A 36.51,67.63 36.51,75.09 38.58,77.15 63.82,77.15 64.77,76.2 64.77,71.44 66.2,70.01 69.22,70.01 70.01,70.8 72.39,70.8 POWER.+
N$64
  Bottom 0.813: IC4.14 80.64,44.45 MOTOR.6
N$65
  Bottom 0.813: IC4.11 80.01,36.83 80.8,36.04 82.23,34.61 82.71,34.13 84.45,32.38 MOTOR.3
N$66
  Top 0.406: IC4.9 80.17,31.75 81.44,33.02 81.44,42.39 80.64,43.18 78.11,43.18 77.15,44.13 77.15,45.09 76.2,46.04 76.2,47.94 74.61,49.53 IC4.1
  Bottom 0.406: 75.25,28.57 78.42,31.75 IC4.9 | JP3.6 78.74,21.59 75.25,25.08 75.25,28.57 | 75.25,28.57 R5.2
N$67
  Bottom 0.406: 77.47,38.1 81.12,38.1
  Bottom 0.813: 81.12,38.1 84.3,34.92 MOTOR.4 | 77.47,38.1 76.83,38.1 75.56,36.83 IC4.6
N$68
  Bottom 0.406: 77.47,40.64 81.12,40.64
  Bottom 0.813: 81.12,40.64 82.07,39.69 82.39,39.37 84.3,37.47 MOTOR.5 | 77.47,40.64 76.83,40.64 73.03,44.45 IC4.3 | MOTOR.5
N$70
  Top 0.406: JP1.4 27.94,65.72 24.08,69.58 21.01,69.58 20.95,69.53 20.93,69.55 USB.2
N$71
  Bottom 0.406: R7.2 9.84,17.78 8.18,16.11 8.18,14.37 7.22,13.41 7.22,11.91 8.89,10.24 9.05,10.24 9.13,10.24 9.29,10.24 10.08,9.45 10.16,9.37 13.18,6.35 PROG.9
N$72
  Bottom 0.406: R17.2 46.99,16.51 44.45,13.97 42.23,13.97 41.59,13.34 41.59,12.7 39.21,10.32 27.15,10.32 26.35,9.53 23.81,6.99 PROG.1 | PROG.1 | PROG.1
N$73
  Bottom 0.406: R18.2 50.16,12.22 49.05,11.11 43.34,11.11 41.43,11.11 39.69,9.37 27.62,9.37 25.4,7.14 25.4,5.71 24.77,5.08 20,5.08 PROG.5 | PROG.5
N$74
  Bottom 0.406: R2.1 R1.1 25.88,53.98 23.5,56.36 23.5,62.87 24.77,62.87
  Bottom 0.813: P1.2 22.23,62.87 24.77,62.87 JP1.1
N$75
  Bottom 0.406: R19.1 63.02,22.38 | 63.02,22.38 63.06,22.42 | S3.1 63.11,22.47 63.02,22.38
N$76
  Bottom 0.406: S4.1 64.49,6.39 65.56,7.46 65.56,12.7 66.99,14.13 66.99,20.4 67.94,21.35 70.88,21.35 71.75,22.23 71.75,24.13 R6.1
N$77
  Bottom 0.813: R20.2 81.44,6.99 82.71,8.26 86.68,8.26 87.79,9.37 87.79,12.7 | 87.79,12.7 87.79,20.32 87.15,20.95 SERVO2.+ | 87.79,12.7 SERVO1.+
RA0
  Bottom 0.406: EXP.6 2.86,53.34 0.95,51.44 0.95,30.64 2.38,29.21 6.99,29.21 7.62,29.84 7.62,30.8 10.48,33.66 12.7,33.66 IC1.2
RA1
  Bottom 0.406: EXP.8 3.02,50.64 1.75,49.37 1.75,32.38 2.38,31.75 6.99,31.75 9.68,34.45 13.1,34.45 13.89,33.66 15.24,33.66 IC1.3
RA2
  Bottom 0.406: EXP.10 4.45,46.99 4.45,34.77 4.92,34.29 7.46,34.29 8.41,35.24 13.49,35.24 14.29,34.45 15.64,34.45 16.43,33.66 17.78,33.66 18.41,33.02 IC1.4
RA3  (via drill 0.6)
  Top 0.406: EXP.12 4.45,46.99 6.67,46.99 10.64,43.02 v11.75,43.02
  Bottom 0.406: v11.75,43.02 11.67,43.02 11.43,42.78 8.89,40.24 8.89,37.15 10,36.04 13.89,36.04 14.68,35.24 16.03,35.24 16.83,34.45 19.53,34.45 IC1.5
RA4  (via drill 0.5, 0.6)
  Top 0.406: v12.22,41.59 9.37,41.59 6.51,44.45 4.45,44.45 EXP.14 | IC1.6 24.77,34.92 27.62,37.78 27.62,40.48 28.73,41.59 v28.73,42.7 | v45.56,40.32 46.35,39.53 | 46.35,39.53 | 46.35,39.53 46.51,39.37 47.47,39.37 47.78,39.05 50.64,39.05 50.8,39.21 51.75,39.21 52.55,38.42 v53.98,38.42
  Bottom 0.406: v12.22,41.59 11.43,41.59 9.68,39.85 9.68,37.62 10.48,36.83 14.29,36.83 15.08,36.04 16.43,36.04 17.22,35.24 19.92,35.24 20.72,34.45 21.51,33.66 22.86,33.66 IC1.6 | v28.73,42.7 28.73,42.23 30.16,40.8 31.59,40.8 32.38,40.01 45.24,40.01 v45.56,40.32 | v53.98,38.42 60.48,38.42 63.34,35.56 76.83,35.56 78.11,34.29 IC4.10
RA5  (via drill 0.6)
  Top 0.406: EXP.16 4.45,41.91 6.51,41.91 8.26,40.16 v11.75,40.16
  Bottom 0.406: v11.75,40.16 11.11,39.53 11.11,38.58 12.06,37.62 14.68,37.62 15.48,36.83 16.83,36.83 17.62,36.04 20.32,36.04 21.91,34.45 24.61,34.45 26.04,33.02 IC1.7
RB0  (via drill 0.6)
  Top 0.406: v39.53,41.27 37.94,41.27 34.13,45.09 33.66,45.56 v33.66,48.9 | v49.37,43.02 49.37,43.18 52.55,43.18 52.86,43.18 54.13,43.18 54.45,42.86 54.77,42.55 v54.93,42.55 | v62.07,41.91 63.34,43.18 66.67,43.18 69.22,40.64 69.22,37.94 69.85,37.31 69.85,30.96 v70.96,29.84
  Bottom 0.406: EXP.5 7.94,53.34 9.21,54.61 9.53,54.61 20.48,54.61 21.27,55.4 22.54,55.4 23.34,54.61 23.34,51.59 24.92,50.01 26.19,50.01 27.3,48.9 28.26,48.9 29.84,47.31 IC1.33 31.75,48.9 v33.66,48.9 | v39.53,41.27 44.29,41.27 45.88,42.86 49.21,42.86 v49.37,43.02 | v54.93,42.55 61.44,42.55 v62.07,41.91 | v70.96,29.84 70.96,27.94 70.96,26.51 70.01,25.56 69.53,25.08 69.06,25.08 67.47,23.5 67.47,22.3 65.88,20.72 65.88,14.45 64.14,12.7 59.69,12.7 57.75,14.64 S5.1
RB1  (via drill 0.6)
  Top 0.406: v10.16,5.08 24.77,5.08 26.51,3.33 26.67,3.17 v26.67,2.54 | v1.27,24.45 0.79,24.92 0.79,50.64 2.22,52.07 4.45,52.07 EXP.7
  Bottom 0.406: IC1.34 27.3,47.47 26.19,48.58 25.72,49.05 24.61,49.05 20,53.66 9.53,53.66 6.67,50.8 EXP.7 | v10.16,5.08 9.84,5.08 6.83,8.1 3.02,8.1 0.95,10.16 0.95,24.13 v1.27,24.45 | v26.67,2.54 27.46,3.33 42.23,3.33 | 42.23,3.33 | 42.23,3.33 70.8,3.33 71.12,3.02 73.5,3.02 78.11,7.62 78.11,9.05 78.11,9.37 | 78.11,10.12 78.11,10.16 | 78.11,10.12 S6.1 | 78.11,9.37 | 78.11,9.37 78.11,10.12
RB2  (via drill 0.6)
  Top 0.406: IC1.35 24.77,45.72 23.02,43.97 23.02,42.39 15.88,35.24 15.88,28.57 17.46,26.99 17.46,24.29 18.89,22.86 25.72,22.86 27.62,20.95 27.62,16.83 28.57,15.88 v28.57,7.94
  Bottom 0.406: EXP.9 5.71,48.58 6.67,49.53 9.05,51.91 9.68,52.55 9.84,52.7 19.53,52.7 24.77,47.47 IC1.35 | v28.57,7.94 28.89,8.26 38.73,8.26 41.12,5.87 49.69,5.87 59.05,5.87 59.85,5.87 61.91,7.94 63.18,7.94 64.1,8.85 S2.1
RB3  (via drill 0.6)
  Top 0.406: v47.31,40.48 | v47.31,40.48 47.47,40.32 47.78,40.32 48.1,40.01 50.48,40.01 50.64,40.16 52.07,40.16 52.23,40.01 52.55,39.69 54.61,39.69 v54.93,40.01
  Bottom 0.406: EXP.11 7.14,47.15 7.14,48.74 7.46,49.05 8.26,49.85 9.53,51.12 10.16,51.75 19.05,51.75 22.23,48.58 IC1.36 22.23,44.85 22.62,44.45 25.48,41.59 28.18,41.59 29.77,40.01 31.27,40.01 32.07,39.21 46.2,39.21 47.31,40.32 v47.31,40.48 | v54.93,40.01 55.09,40.16 61.91,40.16 63.02,40.16 63.98,41.12 63.98,42.7 61.91,44.77 61.91,47.62 62.71,48.42 63.98,48.42 64.61,47.78 64.61,45.72 66.04,44.29 67.79,44.29 70.48,46.99 IC4.2
RB4  (via drill 0.6)
  Top 0.406: v47.31,36.04 50.01,36.04 50.16,35.88 53.18,35.88 v53.34,36.04 | v71.75,20.32 71.44,20.64 68.9,20.64 61.28,20.64 58.42,23.5 R19.2 | R19.2
  Bottom 0.406: EXP.13 7.94,45.4 7.94,48.26 9.21,49.53 9.84,50.16 10.48,50.8 14.61,50.8 16.51,48.9 18.26,48.9 19.68,47.47 IC1.37 19.68,46.04 18.57,44.93 18.57,43.02 19.53,42.07 19.68,41.91 20.8,40.8 22.7,40.8 24.29,39.21 26.99,39.21 28.57,37.62 30.08,37.62 30.88,36.83 33.18,36.83 33.66,36.35 35.08,36.35 35.4,36.04 36.35,36.04 36.83,36.51 46.83,36.51 v47.31,36.04 | v53.34,36.04 59.69,36.04 61.59,34.13 61.59,30.48 59.85,28.73 59.85,27.78 59.85,26.19 59.05,25.4 R19.2 | v71.75,20.32 81.28,20.32 84.45,23.5 SERVO2.S
RB5  (via drill 0.6)
  Top 0.406: v46.35,33.66 46.67,33.97 56.2,33.97 56.36,33.81 v56.52,33.66 | v58.42,27.3 58.58,27.3 60.17,25.72 65.09,25.72 R6.2 66.04,24.77 66.67,24.77 67.31,24.77 71.12,24.77 72.55,23.34 79.85,23.34 80.33,22.86 80.49,22.7 80.96,22.23 80.96,18.1 83.82,15.24 SERVO1.S
  Bottom 0.406: EXP.15 8.73,43.66 8.73,46.35 8.73,46.67 8.73,47.78 10.79,49.85 14.29,49.85 IC1.38 17.14,43.18 20.32,40.01 22.3,40.01 23.89,38.42 26.59,38.42 28.18,36.83 29.69,36.83 30.48,36.04 32.86,36.04 33.34,35.56 34.61,35.56 35.08,35.08 36.67,35.08 37.15,35.56 44.45,35.56 v46.35,33.66 | R18.1 50.16,24.13 51.28,23.02 52.55,23.02 53.02,23.5 54.29,23.5 55.56,24.77 55.56,26.04 55.56,26.83 55.56,29.37 56.2,30 56.52,30.32 56.52,33.18 v56.52,33.66 | v56.52,33.66 | v56.52,33.66 56.83,33.97 58.42,33.97 59.05,33.34 59.05,27.94 v58.42,27.3
RB6  (via drill 0.6)
  Top 0.406: v33.66,33.66 v33.66,28.57 | v42.55,27.78 44.61,27.78 R17.1 | R17.1 | R1.2 21.91,53.66 17.62,49.37 15.72,49.37 14.61,48.26 IC1.39
  Bottom 0.406: EXP.17 7.14,39.53 7.14,40.88 9.53,43.26 9.53,47.31 11.11,48.9 13.65,48.9 14.61,47.94 IC1.39 14.61,41.91 17.3,39.21 18.02,39.21 18.81,38.42 21.51,38.42 23.1,36.83 25.8,36.83 27.38,35.24 28.89,35.24 29.69,34.45 31.75,34.45 32.54,33.66 v33.66,33.66 | v33.66,28.57 34.61,28.57 35.56,27.62 36.83,27.62 37.47,28.26 40.32,28.26 40.8,27.78 v42.55,27.78
RB7  (via drill 0.6)
  Top 0.406: EXP.19 5.56,35.4 4.45,34.29 4.45,32.38 3.81,31.75 2.22,31.75 1.75,31.27 1.75,26.83 v1.91,26.67
  Bottom 0.406: IC1.40 10.32,45.24 10.32,42.86 8.1,40.64 8.1,37.94 EXP.19 | R7.1 10,25.4 8.73,26.67 v1.91,26.67
RC0  (via drill 0.6)
  Top 0.406: EXP.24 4.45,29.21 9.53,29.21 v10.16,29.84 | v46.35,41.59 47.78,41.59 48.26,41.12 | 48.26,41.12 | 48.26,41.12 48.42,40.96 50.16,40.96 50.48,41.27 52.23,41.27 52.86,40.64 53.82,40.64 54.29,41.12 58.26,41.12 62.71,45.56 63.98,45.56 64.61,46.2 64.61,48.42 64.61,48.9 63.82,49.69 61.59,51.91 58.58,51.91 R3.2
  Bottom 0.406: v10.16,29.84 27.94,29.84 28.1,29.84 30.96,29.84 31.11,29.84 45.88,29.84 47.62,31.59 IC1.15 47.62,33.02 48.58,33.97 48.58,40.8 47.78,41.59 v46.35,41.59
RC1  (via drill 0.6)
  Top 0.406: EXP.26 4.45,26.67 6.51,26.67 8.1,28.26 11.43,28.26 11.91,28.26 v12.38,28.73 | v14.76,27.78 15.4,27.78 16.67,26.51 16.67,23.81 18.57,21.91 24.13,21.91 v24.45,21.59 | v24.45,21.59 | v51.91,27.46 51.91,29.69 50.16,31.43 IC1.16 | v51.91,27.46 53.66,27.46 54.61,28.42 59.05,28.42 60.48,26.99 61.59,26.99 62.71,28.1 v62.71,28.89 | v68.58,34.29 v68.58,36.83 | v44.45,23.18 44.77,22.86 48.26,22.86 v48.58,23.18 | v51.91,27.46
  Bottom 0.406: v12.38,28.73 13.81,28.73 v14.76,27.78 | v62.71,28.89 62.71,29.37 66.04,32.7 66.36,33.02 67.63,34.29 v68.58,34.29 | v68.58,36.83 68.58,43.81 70.48,45.72 76.83,45.72 78.11,46.99 IC4.15 | v44.45,23.18 43.66,22.38 37.15,22.38 36.99,22.23 33.66,22.23 33.18,22.7 25.56,22.7 v24.45,21.59 | v48.58,23.18 48.58,26.04 49.69,27.15 49.85,27.3 51.75,27.3 v51.91,27.46
RC2  (via drill 0.6)
  Top 0.406: v8.26,23.81 8.26,24.61 8.26,25.88 9.05,26.67 15.24,26.67 15.88,26.04 15.88,23.34 18.26,20.95 23.18,20.95 24.13,20 v24.45,20 | 53.18,29.21 53.18,30 52.7,30.48 IC1.17 | v53.18,28.65 53.18,29.21 | 53.18,29.21 60.17,29.21 60.48,28.89 v61.12,28.26 | v44.45,20.64 44.77,20.32 50.48,20.32 51.91,21.75 v51.91,24.45
  Bottom 0.406: v8.26,23.81 7.94,24.13 4.45,24.13 EXP.28 | IC4.7 70.33,34.29 69.22,33.18 67.79,33.18 66.52,31.91 63.98,29.37 63.98,28.42 63.34,27.78 61.59,27.78 v61.12,28.26 | v44.45,20.64 43.5,21.59 40.64,21.59 37.62,21.59 37.47,21.43 33.18,21.43 33.02,21.59 26.35,21.59 24.77,20 v24.45,20 | v51.91,24.45 51.91,25.72 53.18,26.99 v53.18,28.65
RC4  (via drill 0.6)
  Top 0.406: v13.49,13.97 10,13.97 7.94,16.03 7.94,18.1 6.99,19.05 2.38,19.05 1.75,19.68 1.75,21.43 3.02,22.7 EXP.30 | v65.09,33.34 65.41,33.02 65.41,32.23 65.41,31.59 68.9,28.1 v68.9,26.99 | v35.08,13.97 49.85,13.97 v53.02,17.14
  Bottom 0.406: v13.49,13.97 v35.08,13.97 | v65.09,33.34 64.29,33.34 60.33,37.31 53.5,37.31 52.86,37.94 52.86,38.58 52.07,39.37 52.07,43.81 IC1.23 55.24,48.74 50.48,53.5 50.48,59.37 48.9,60.96 46.99,60.96 44.77,63.18 44.45,63.5 38.1,63.5 36.99,62.39 35.56,62.39 33.81,64.14 28.57,64.14 27.94,63.5 JP1.3 | v53.02,17.14 54.45,17.14 56.52,19.21 60.17,22.86 61.75,24.45 64.29,24.45 64.77,23.97 65.88,23.97 67.23,25.32 v68.9,26.99
RC5  (via drill 0.6)
  Top 0.406: v28.26,50.8 27.62,50.16 25.08,50.16 23.5,48.58 23.5,45.72 22.07,44.29 22.07,42.7 13.34,33.97 13.34,30.16 13.65,29.84 13.65,28.26 12.86,27.46 8.57,27.46 7.3,26.19 7.3,24.92 6.51,24.13 4.92,24.13 4.45,23.65 4.45,21.59 EXP.32 | v38.1,50.16 39.69,50.16 39.85,50.01 40.96,48.9 43.02,48.9 43.81,48.1 43.81,47.94 43.81,45.72 44.45,45.09 51.44,45.09 52.7,46.35 IC1.24
  Bottom 0.406: v28.26,50.8 28.89,51.44 34.61,51.44 | 34.61,51.44 36.83,51.44 v38.1,50.16 | 34.61,51.44 34.61,54.29 33.97,54.93 33.5,55.4 29.69,55.4 28.57,56.52 28.57,59.69 30.48,61.59 JP1.5
RC6  (via drill 0.6)
  Top 0.406: v8.81,9.05 10.95,9.05 11.91,10 12.86,10 v13.49,10.64 | v51.44,50.48 52.39,50.48 53.18,50.48 54.61,49.05 58.58,49.05 v58.74,49.21
  Bottom 0.406: v13.49,10.64 13.81,10.32 25.56,10.32 26.51,11.27 38.73,11.27 39.37,11.91 39.37,13.02 39.37,14.61 39.37,15.56 38.42,16.51 38.1,16.51 37.31,17.3 37.31,18.26 38.26,19.21 42.07,19.21 44.77,19.21 45.72,20.16 45.72,24.61 45.56,24.77 45.56,25.88 46.67,26.99 46.83,27.15 49.53,29.84 50.8,29.84 51.44,30.48 51.44,33.18 50.16,34.45 50.16,38.58 51.28,39.69 51.28,44.77 50.16,45.88 IC1.25 50.16,47.62 51.44,48.9 v51.44,50.48 | 65.41,59.53 61.59,55.72 61.59,52.55 60.96,51.91 59.69,51.91 58.9,51.12 58.9,49.37 v58.74,49.21 | v58.74,49.21 | IC3.11 | IC3.11 | 65.41,59.53 | 65.41,59.53 IC3.11 | EXP.34 1.75,16.35 1.75,12.06 2.38,11.43 6.43,11.43 v8.81,9.05 9.21,9.05 12.06,6.19 12.06,5.87 13.65,4.29 PROG.10
RC7
  Top 0.406: EXP.36 3.49,15.24 4.45,14.29 4.45,9.21 5.08,8.57 5.79,8.57 7.86,6.51 11.75,6.51 13.02,7.78 14.76,7.78 PROG.7
  Bottom 0.406: 47.62,45.4 48.42,44.61 49.53,44.61 50.48,43.66 50.48,40.16 49.37,39.05 49.37,38.73 49.37,33.5 48.9,33.02 48.9,30.48 46.99,28.57 45.72,27.3 45.24,26.83 44.77,26.35 44.13,25.72 42.55,24.13 41.59,23.18 36.67,23.18 36.51,23.02 34.13,23.02 33.18,23.97 22.7,23.97 18.1,19.37 10,19.37 9.84,19.21 7.3,16.67 7.3,14.76 6.51,13.97 4.76,13.97 3.49,15.24 EXP.36 | 47.62,45.4 | IC1.26 | 47.62,45.4 47.62,46.83 IC1.26 | 33.97,61.28 37.15,61.28 38.42,62.55 44.13,62.55 46.67,60.01 48.42,60.01 48.74,59.69 49.37,59.05 49.37,52.55 47.62,50.8 IC1.26 | JP1.7 33.02,62.23 33.97,61.28 | 33.97,61.28
RD0  (via drill 0.6)
  Top 0.406: EXP.21 8.57,35.88 12.7,35.88 16.19,39.37 v16.19,42.23 18.41,44.45 18.41,48.18 19.13,48.9 20,48.9 24.77,53.66 LCD.7 | v36.2,33.81 v36.2,28.73 | v48.58,21.59 48.26,21.91 43.02,21.91 41.91,23.02 R16.1
  Bottom 0.406: 57.15,29.69 56.52,29.05 56.52,28.73 56.52,26.99 56.52,24.45 54.61,22.54 53.34,22.54 52.86,22.07 52.23,22.07 51.91,22.07 49.85,22.07 49.37,21.59 v48.58,21.59 | 57.15,29.69 | 57.15,29.69 57.78,30.32 IC1.19 | v16.19,42.23 17.46,40.96 17.94,40.48 18.41,40.01 18.49,39.93 19.21,39.21 21.91,39.21 23.5,37.62 26.19,37.62 27.78,36.04 29.29,36.04 30.08,35.24 32.23,35.24 32.7,34.77 34.13,34.77 35.08,33.81 v36.2,33.81 | v36.2,28.73 36.51,29.05 43.02,29.05 43.81,28.26 43.81,27.3 42.07,25.56 R16.1
RD1  (via drill 0.6)
  Top 0.406: EXP.23 10.16,34.92 13.02,34.92 17.14,39.05 17.14,40.16 20.95,43.97 | 20.95,43.97 20.95,48.42 27.3,54.77 LCD.8 | 20.95,43.97 v20.8,43.81 | v46.99,38.26 | v46.99,38.26 47.15,38.1 51.2,38.1 v51.28,38.02 | R15.1 39.05,25.72 40.16,25.72 40.96,26.51 40.96,27.94 42.07,29.05 49.53,29.05 v50.01,28.57
  Bottom 0.406: 53.98,34.92 53.98,30.48 53.34,29.84 52.07,29.84 51.44,29.21 50.8,28.57 v50.01,28.57 | 53.98,34.92 59.37,34.92 59.69,34.61 60.33,33.97 IC1.20 | v20.8,43.81 22.23,42.39 23.5,42.39 25.08,40.8 27.78,40.8 29.37,39.21 30.88,39.21 31.35,38.73 31.67,38.42 46.83,38.42 v46.99,38.26 | v51.28,38.02 51.28,37.31 51.28,37.15 51.28,35.88 52.23,34.92 52.7,34.92 53.98,34.92
RD2  (via drill 0.6)
  Top 0.406: v37.39,52.47 37.78,52.07 40.32,52.07 41.75,50.64 43.97,50.64 45.09,49.53 48.42,49.53 48.9,49.05 53.18,49.05 53.98,48.26 53.98,45.72 54.61,45.09 58.74,45.09 60.33,46.67 IC1.21 | 40.64,20.32 41.59,19.37 51.28,19.37 v51.91,20 | v66.83,45.4 69.53,45.4 69.85,45.72 73.34,45.72 74.93,44.13 v74.93,33.34 | 40.64,20.32 | R14.1 40.64,20.32
  Bottom 0.406: 36.35,53.82 35.56,54.61 33.66,56.52 33.66,59.37 33.02,60.01 31.11,60.01 29.84,58.74 LCD.9 | EXP.25 8.73,27.94 9.92,26.75 11.35,26.75 12.86,25.24 13.97,24.13 15.24,24.13 15.88,24.77 15.88,27.15 17.78,29.05 19.37,29.05 30.96,29.05 33.18,26.83 33.97,26.83 34.13,26.83 R14.1 | IC1.21 60.33,47.31 62.39,49.37 64.45,49.37 65.72,48.1 65.72,46.51 v66.83,45.4 | v66.83,45.4 | v74.93,33.34 74.61,33.02 70.48,33.02 69.85,32.38 69.85,30.64 66.52,27.3 64.14,27.3 63.66,26.83 62.87,26.83 | R14.1 | 62.87,26.83 56.36,20.32 56.04,20 55.09,19.05 52.86,19.05 v51.91,20 | 62.87,26.83 | 36.35,53.82 | v37.39,52.47 37.39,52.78 36.35,53.82
RD3  (via drill 0.6)
  Top 0.406: LCD.10 34.29,55.88 41.91,55.88 42.55,55.24 48.9,55.24 49.53,55.88 v53.98,55.88 | v53.34,41.91 53.02,42.23 50.16,42.23 49.85,41.91 48.74,41.91 48.26,42.39 47.47,42.39 47.15,42.7 45.72,42.7 44.29,41.27 44.29,37.47 41.27,34.45 41.27,29.69 40.01,28.42 40.01,27.3 v39.69,26.99
  Bottom 0.406: EXP.27 8.73,25.4 10.16,23.97 | 10.16,23.97 | 10.16,23.97 10.79,23.34 15.72,23.34 16.67,24.29 16.67,26.67 18.26,28.26 20,28.26 29.53,28.26 31.75,26.04 R13.1 33.02,25.4 34.61,23.81 36.04,23.81 36.2,23.97 39.37,23.97 40.01,24.61 40.01,26.67 v39.69,26.99 | v53.34,41.91 53.34,43.34 54.45,44.45 56.2,44.45 57.78,46.04 IC1.22 57.78,47.62 56.2,49.21 | 56.2,49.21 | 56.2,49.21 53.98,51.44 v53.98,55.88
RD4  (via drill 0.6)
  Top 0.406: v31.91,42.07 31.75,42.07 29.29,39.61 29.29,37.07 28.57,36.35 28.57,26.04 R12.1
  Bottom 0.406: LCD.11 38.73,61.59 43.81,61.59 46.35,59.05 46.35,56.52 45.72,55.88 45.4,55.56 44.45,55.56 43.66,54.77 43.66,49.69 45.09,48.26 IC1.27 45.09,46.83 43.18,44.93 41.91,44.93 40.96,43.97 39.53,43.97 38.26,42.7 32.54,42.7 v31.91,42.07 | EXP.29 6.35,22.86 6.67,22.86 | 6.67,22.86 | 6.67,22.86 6.99,22.86 7.3,22.54 16.19,22.54 17.46,23.81 17.46,26.19 18.73,27.46 27.78,27.46 29.21,26.04 R12.1
RD5  (via drill 0.6)
  Top 0.406: v30.32,42.39 30.32,41.91 28.42,40.01 28.42,37.47 26.04,35.08 R11.1
  Bottom 0.406: LCD.12 37.47,59.05 39.05,60.64 42.86,60.64 43.81,59.69 43.81,56.52 42.78,55.48 42.78,48.18 42.55,47.94 IC1.28 42.55,46.83 40.64,44.93 39.21,44.93 37.78,43.5 31.43,43.5 v30.32,42.39 | EXP.31 7.14,21.75 16.67,21.75 18.41,23.5 18.41,26.04 19.05,26.67 | 19.05,26.67 | 19.05,26.67 21.59,26.67 25.4,26.67 26.04,26.04 R11.1
RD6  (via drill 0.6)
  Top 0.406: v27.15,43.02 27.15,41.27 26.75,40.88 26.75,38.18 23.5,34.92 23.5,26.04 R10.1
  Bottom 0.406: LCD.13 41.91,55.88 41.91,53.5 41.91,49.21 40.01,47.31 IC1.29 39.85,46.83 37.31,44.29 28.42,44.29 v27.15,43.02 | EXP.33 6.67,17.78 9.05,20.16 10.95,20.16 11.59,20.16 17.62,20.16 R10.1
RD7  (via drill 0.6)
  Top 0.406: v25.56,43.34 25.88,43.02 25.88,40.96 25.88,40.64 25.88,38.58 20.95,33.66 20.95,26.67 R9.1
  Bottom 0.406: LCD.14 42.55,59.05 41.91,59.69 39.37,59.69 38.73,59.05 38.73,53.66 39.69,52.7 39.85,52.55 39.85,49.37 39.37,48.9 IC1.30 37.47,46.51 36.04,45.09 26.35,45.09 25.56,44.29 v25.56,43.34 | EXP.35 4.45,16.51 4.45,18.41 5.08,19.05 6.67,19.05 7.3,19.68 7.78,20.16 8.57,20.95 9.53,20.95 10.16,20.95 17.14,20.95 19.68,23.5 R9.1
RE0  (via drill 0.6)
  Top 0.406: EXP.18 4.45,39.37 6.51,39.37 6.99,38.89 v12.54,38.89 13.18,39.53 13.18,40.8 13.97,41.59 13.97,43.5 12.7,44.77 11.75,44.77 10.48,46.04 10.48,50.01 12.54,52.07 13.18,52.7 17.14,56.67 LCD.4
  Bottom 0.406: v12.54,38.89 14.61,38.89 15.88,37.62 17.22,37.62 18.02,36.83 20.72,36.83 22.3,35.24 23.97,35.24 25,35.24 26.59,33.66 27.94,33.66 IC1.8 | IC1.8
RE1  (via drill 0.6)
  Top 0.406: EXP.20 4.45,36.83 12.38,36.83 14.45,38.89 v14.45,40.16 14.92,40.64 14.92,44.13 13.34,45.72 13.34,50.48 15.88,53.02 19.68,56.83 19.68,57.31 LCD.5
  Bottom 0.406: v14.45,40.16 14.61,40.16 15.08,39.69 16.35,38.42 17.62,38.42 18.41,37.62 21.11,37.62 21.91,36.83 22.7,36.04 25.4,36.04 26.19,35.24 26.35,35.08 26.99,34.45 28.5,34.45 29.29,33.66 31.11,33.66 32.38,32.38 IC1.9
RE2  (via drill 0.6)
  Top 0.406: LCD.6 22.23,56.2 20.4,54.37 19.61,53.58 17.3,51.28 | EXP.22 1.75,34.45 1.75,48.9 2.38,49.53 6.67,49.53 8.1,50.96 v8.1,55.4 | v35.88,37.31 34.92,36.35 IC1.10 | 17.3,51.28 17.22,51.2 | v16.83,50.56 16.83,50.8 17.3,51.28
  Bottom 0.406: v16.83,50.56 18.57,50.56 20.95,48.18 20.95,45.72 19.53,44.29 19.53,43.34 20.8,42.07 21.27,41.59 23.1,41.59 24.69,40.01 27.38,40.01 28.97,38.42 30.48,38.42 31.27,37.62 33.5,37.62 33.81,37.31 v35.88,37.31 | v8.1,55.4 8.73,55.4 8.89,55.56 20.16,55.56 22.23,57.63 LCD.6
RST  (via drill 0.6)
  Top 0.406: v12.7,16.51 12.7,20.16 14.61,22.07 R8.1 | v8.41,12.7 EXP.37
  Bottom 0.406: 23.34,3.33 22.38,2.38 15.56,2.38 14.92,3.02 14.92,7.3 14.29,7.94 12.86,7.94 10.87,9.92 9.68,11.11 9.21,11.11 8.41,11.91 v8.41,12.7 8.41,13.34 9.05,13.97 9.05,15.56 10,16.51 v12.7,16.51 | R8.1 13.97,25.4 11.75,27.62 10.32,27.62 8.89,29.05 8.89,30.32 10.32,31.75 IC1.1 12.22,31.75 | 30.96,6.39 S1.1 | 30.96,6.39 27.66,6.39 25.08,3.81 PROG.2 23.34,3.33 | 30.96,6.39 30.96,6.35 | 23.34,3.33

### Text on the board
tPlace: power | 2 | 1 | LCD | expansion connector | N | W | C | E | 40 | 39 | RESET | S | board v1.1